# EAGLE schematic ls schematic v30 (EAGLE 9.7.0)
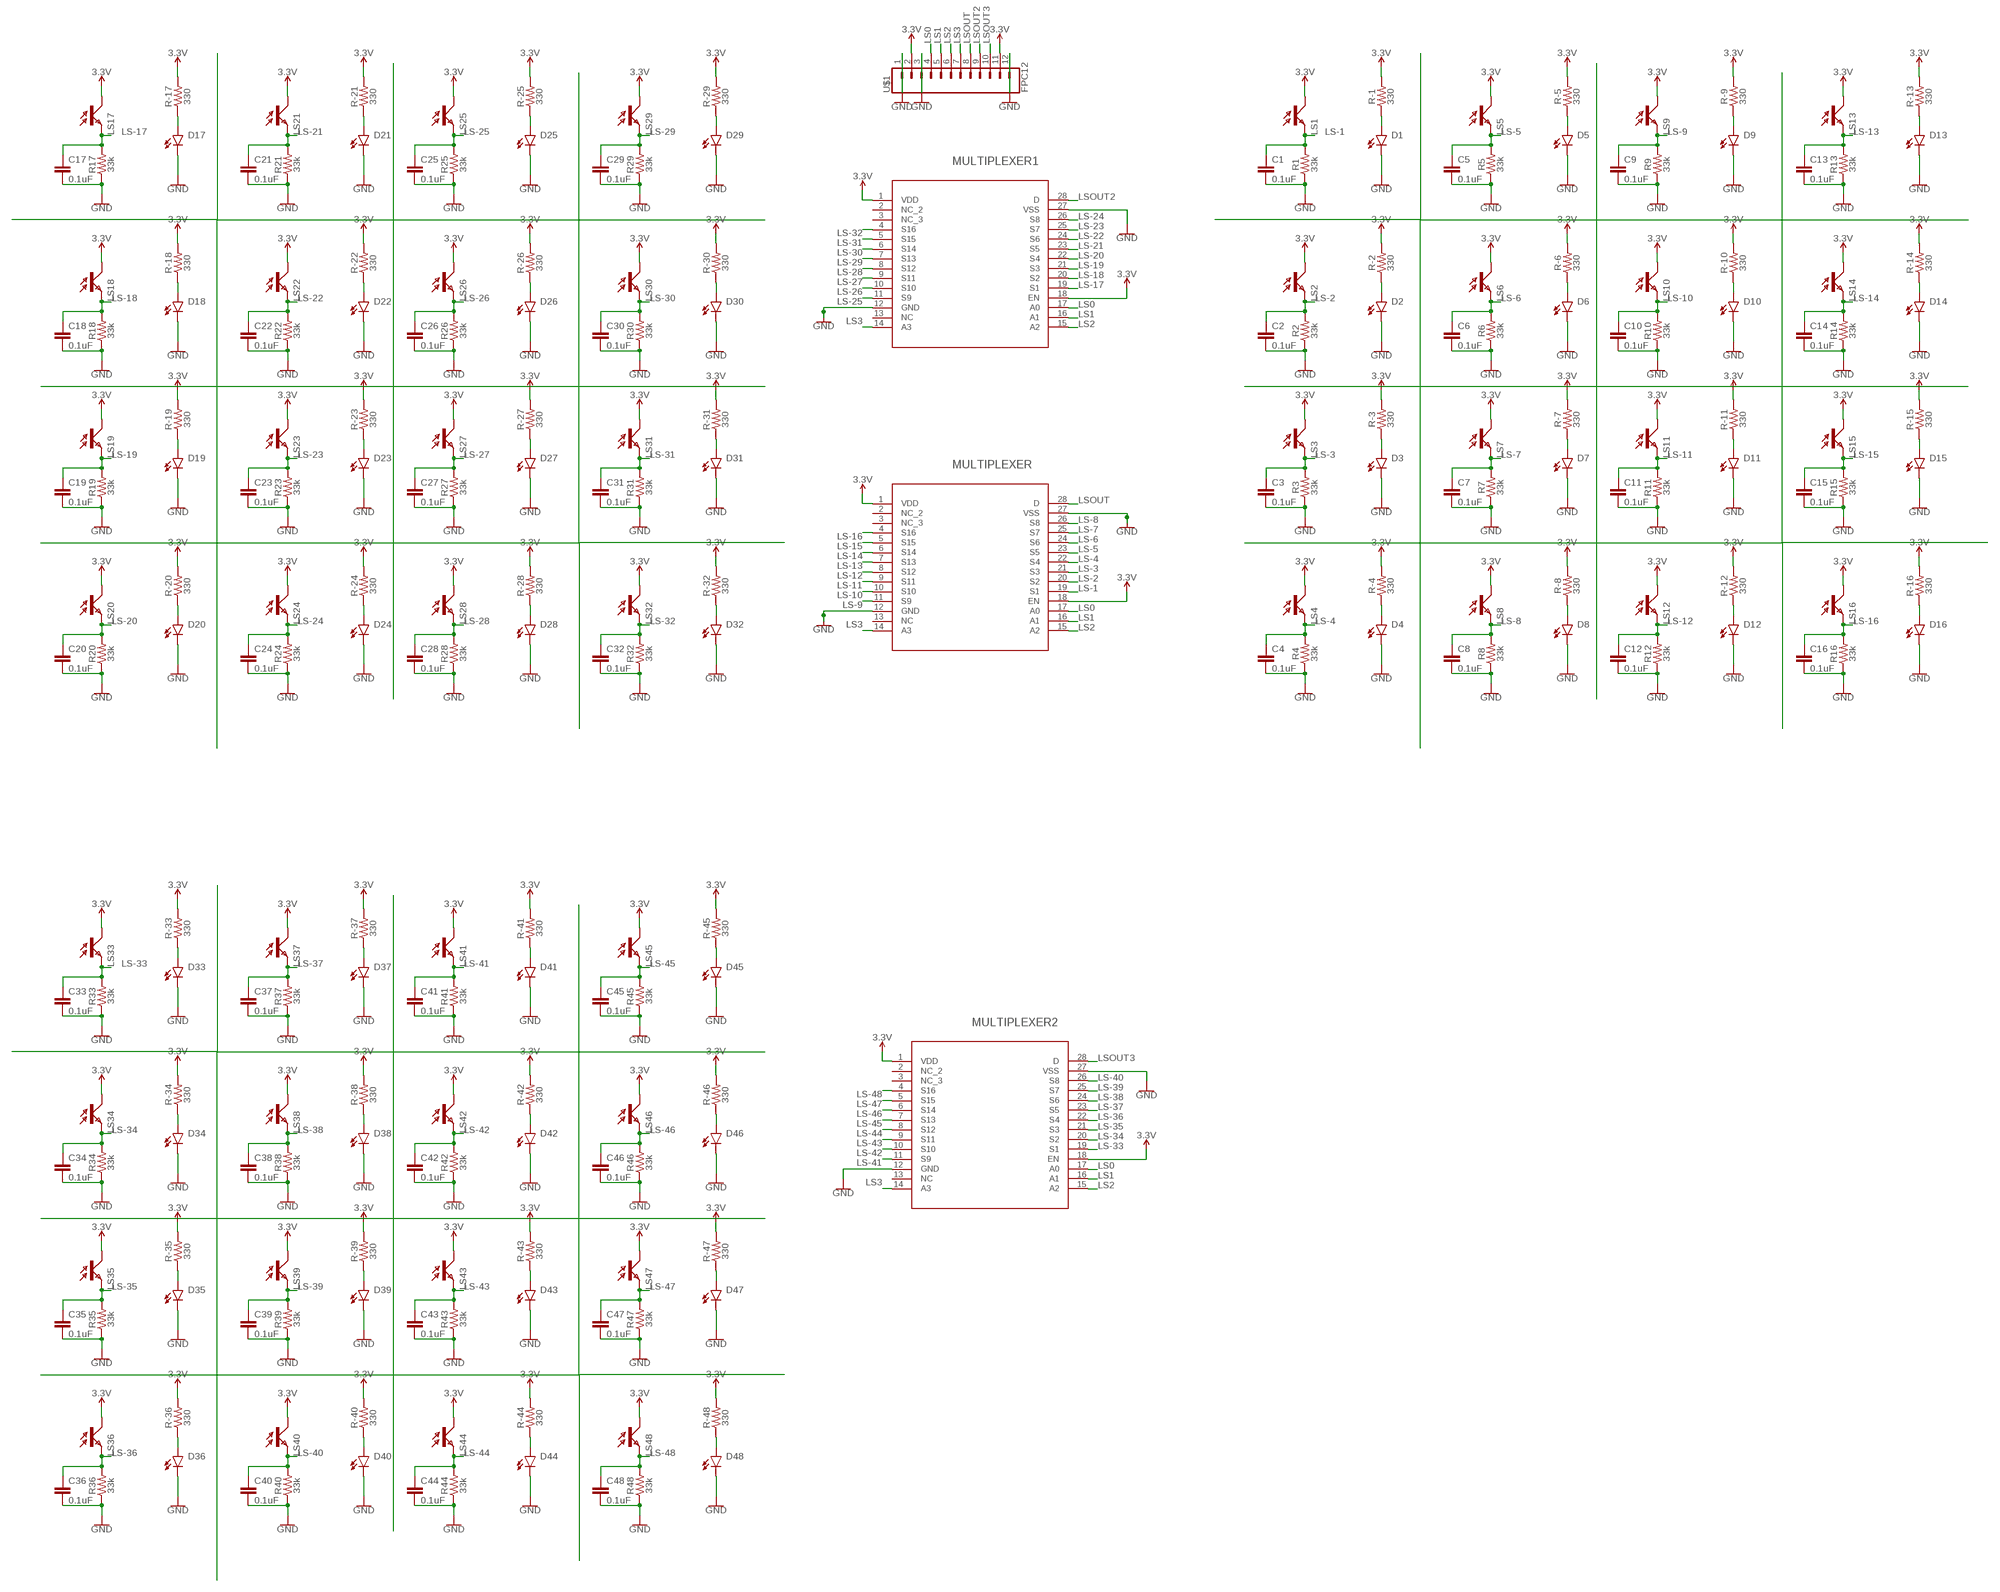
[diagram p0: schematic, sheet 1]

## Parts
C1  0.1uF  0.1UF-0603-100V-10%  [0603]
C2  0.1uF  0.1UF-0603-100V-10%  [0603]
C3  0.1uF  0.1UF-0603-100V-10%  [0603]
C4  0.1uF  0.1UF-0603-100V-10%  [0603]
C5  0.1uF  0.1UF-0603-100V-10%  [0603]
C6  0.1uF  0.1UF-0603-100V-10%  [0603]
C7  0.1uF  0.1UF-0603-100V-10%  [0603]
C8  0.1uF  0.1UF-0603-100V-10%  [0603]
C9  0.1uF  0.1UF-0603-100V-10%  [0603]
C10  0.1uF  0.1UF-0603-100V-10%  [0603]
C11  0.1uF  0.1UF-0603-100V-10%  [0603]
C12  0.1uF  0.1UF-0603-100V-10%  [0603]
C13  0.1uF  0.1UF-0603-100V-10%  [0603]
C14  0.1uF  0.1UF-0603-100V-10%  [0603]
C15  0.1uF  0.1UF-0603-100V-10%  [0603]
C16  0.1uF  0.1UF-0603-100V-10%  [0603]
C17  0.1uF  0.1UF-0603-100V-10%  [0603]
C18  0.1uF  0.1UF-0603-100V-10%  [0603]
C19  0.1uF  0.1UF-0603-100V-10%  [0603]
C20  0.1uF  0.1UF-0603-100V-10%  [0603]
C21  0.1uF  0.1UF-0603-100V-10%  [0603]
C22  0.1uF  0.1UF-0603-100V-10%  [0603]
C23  0.1uF  0.1UF-0603-100V-10%  [0603]
C24  0.1uF  0.1UF-0603-100V-10%  [0603]
C25  0.1uF  0.1UF-0603-100V-10%  [0603]
C26  0.1uF  0.1UF-0603-100V-10%  [0603]
C27  0.1uF  0.1UF-0603-100V-10%  [0603]
C28  0.1uF  0.1UF-0603-100V-10%  [0603]
C29  0.1uF  0.1UF-0603-100V-10%  [0603]
C30  0.1uF  0.1UF-0603-100V-10%  [0603]
C31  0.1uF  0.1UF-0603-100V-10%  [0603]
C32  0.1uF  0.1UF-0603-100V-10%  [0603]
C33  0.1uF  0.1UF-0603-100V-10%  [0603]
C34  0.1uF  0.1UF-0603-100V-10%  [0603]
C35  0.1uF  0.1UF-0603-100V-10%  [0603]
C36  0.1uF  0.1UF-0603-100V-10%  [0603]
C37  0.1uF  0.1UF-0603-100V-10%  [0603]
C38  0.1uF  0.1UF-0603-100V-10%  [0603]
C39  0.1uF  0.1UF-0603-100V-10%  [0603]
C40  0.1uF  0.1UF-0603-100V-10%  [0603]
C41  0.1uF  0.1UF-0603-100V-10%  [0603]
C42  0.1uF  0.1UF-0603-100V-10%  [0603]
C43  0.1uF  0.1UF-0603-100V-10%  [0603]
C44  0.1uF  0.1UF-0603-100V-10%  [0603]
C45  0.1uF  0.1UF-0603-100V-10%  [0603]
C46  0.1uF  0.1UF-0603-100V-10%  [0603]
C47  0.1uF  0.1UF-0603-100V-10%  [0603]
C48  0.1uF  0.1UF-0603-100V-10%  [0603]
D1  CHIP-FLAT-B_0603-0.35MM  [LEDC1608X35N_FLAT-B]
D2  CHIP-FLAT-B_0603-0.35MM  [LEDC1608X35N_FLAT-B]
D3  CHIP-FLAT-B_0603-0.35MM  [LEDC1608X35N_FLAT-B]
D4  CHIP-FLAT-B_0603-0.35MM  [LEDC1608X35N_FLAT-B]
D5  CHIP-FLAT-B_0603-0.35MM  [LEDC1608X35N_FLAT-B]
D6  CHIP-FLAT-B_0603-0.35MM  [LEDC1608X35N_FLAT-B]
D7  CHIP-FLAT-B_0603-0.35MM  [LEDC1608X35N_FLAT-B]
D8  CHIP-FLAT-B_0603-0.35MM  [LEDC1608X35N_FLAT-B]
D9  CHIP-FLAT-B_0603-0.35MM  [LEDC1608X35N_FLAT-B]
D10  CHIP-FLAT-B_0603-0.35MM  [LEDC1608X35N_FLAT-B]
D11  CHIP-FLAT-B_0603-0.35MM  [LEDC1608X35N_FLAT-B]
D12  CHIP-FLAT-B_0603-0.35MM  [LEDC1608X35N_FLAT-B]
D13  CHIP-FLAT-B_0603-0.35MM  [LEDC1608X35N_FLAT-B]
D14  CHIP-FLAT-B_0603-0.35MM  [LEDC1608X35N_FLAT-B]
D15  CHIP-FLAT-B_0603-0.35MM  [LEDC1608X35N_FLAT-B]
D16  CHIP-FLAT-B_0603-0.35MM  [LEDC1608X35N_FLAT-B]
D17  CHIP-FLAT-B_0603-0.35MM  [LEDC1608X35N_FLAT-B]
D18  CHIP-FLAT-B_0603-0.35MM  [LEDC1608X35N_FLAT-B]
D19  CHIP-FLAT-B_0603-0.35MM  [LEDC1608X35N_FLAT-B]
D20  CHIP-FLAT-B_0603-0.35MM  [LEDC1608X35N_FLAT-B]
D21  CHIP-FLAT-B_0603-0.35MM  [LEDC1608X35N_FLAT-B]
D22  CHIP-FLAT-B_0603-0.35MM  [LEDC1608X35N_FLAT-B]
D23  CHIP-FLAT-B_0603-0.35MM  [LEDC1608X35N_FLAT-B]
D24  CHIP-FLAT-B_0603-0.35MM  [LEDC1608X35N_FLAT-B]
D25  CHIP-FLAT-B_0603-0.35MM  [LEDC1608X35N_FLAT-B]
D26  CHIP-FLAT-B_0603-0.35MM  [LEDC1608X35N_FLAT-B]
D27  CHIP-FLAT-B_0603-0.35MM  [LEDC1608X35N_FLAT-B]
D28  CHIP-FLAT-B_0603-0.35MM  [LEDC1608X35N_FLAT-B]
D29  CHIP-FLAT-B_0603-0.35MM  [LEDC1608X35N_FLAT-B]
D30  CHIP-FLAT-B_0603-0.35MM  [LEDC1608X35N_FLAT-B]
D31  CHIP-FLAT-B_0603-0.35MM  [LEDC1608X35N_FLAT-B]
D32  CHIP-FLAT-B_0603-0.35MM  [LEDC1608X35N_FLAT-B]
D33  CHIP-FLAT-B_0603-0.35MM  [LEDC1608X35N_FLAT-B]
D34  CHIP-FLAT-B_0603-0.35MM  [LEDC1608X35N_FLAT-B]
D35  CHIP-FLAT-B_0603-0.35MM  [LEDC1608X35N_FLAT-B]
D36  CHIP-FLAT-B_0603-0.35MM  [LEDC1608X35N_FLAT-B]
D37  CHIP-FLAT-B_0603-0.35MM  [LEDC1608X35N_FLAT-B]
D38  CHIP-FLAT-B_0603-0.35MM  [LEDC1608X35N_FLAT-B]
D39  CHIP-FLAT-B_0603-0.35MM  [LEDC1608X35N_FLAT-B]
D40  CHIP-FLAT-B_0603-0.35MM  [LEDC1608X35N_FLAT-B]
D41  CHIP-FLAT-B_0603-0.35MM  [LEDC1608X35N_FLAT-B]
D42  CHIP-FLAT-B_0603-0.35MM  [LEDC1608X35N_FLAT-B]
D43  CHIP-FLAT-B_0603-0.35MM  [LEDC1608X35N_FLAT-B]
D44  CHIP-FLAT-B_0603-0.35MM  [LEDC1608X35N_FLAT-B]
D45  CHIP-FLAT-B_0603-0.35MM  [LEDC1608X35N_FLAT-B]
D46  CHIP-FLAT-B_0603-0.35MM  [LEDC1608X35N_FLAT-B]
D47  CHIP-FLAT-B_0603-0.35MM  [LEDC1608X35N_FLAT-B]
D48  CHIP-FLAT-B_0603-0.35MM  [LEDC1608X35N_FLAT-B]
LS1  ALS  [SMD]
LS2  ALS  [SMD]
LS3  ALS  [SMD]
LS4  ALS  [SMD]
LS5  ALS  [SMD]
LS6  ALS  [SMD]
LS7  ALS  [SMD]
LS8  ALS  [SMD]
LS9  ALS  [SMD]
LS10  ALS  [SMD]
LS11  ALS  [SMD]
LS12  ALS  [SMD]
LS13  ALS  [SMD]
LS14  ALS  [SMD]
LS15  ALS  [SMD]
LS16  ALS  [SMD]
LS17  ALS  [SMD]
LS18  ALS  [SMD]
LS19  ALS  [SMD]
LS20  ALS  [SMD]
LS21  ALS  [SMD]
LS22  ALS  [SMD]
LS23  ALS  [SMD]
LS24  ALS  [SMD]
LS25  ALS  [SMD]
LS26  ALS  [SMD]
LS27  ALS  [SMD]
LS28  ALS  [SMD]
LS29  ALS  [SMD]
LS30  ALS  [SMD]
LS31  ALS  [SMD]
LS32  ALS  [SMD]
LS33  ALS  [SMD]
LS34  ALS  [SMD]
LS35  ALS  [SMD]
LS36  ALS  [SMD]
LS37  ALS  [SMD]
LS38  ALS  [SMD]
LS39  ALS  [SMD]
LS40  ALS  [SMD]
LS41  ALS  [SMD]
LS42  ALS  [SMD]
LS43  ALS  [SMD]
LS44  ALS  [SMD]
LS45  ALS  [SMD]
LS46  ALS  [SMD]
LS47  ALS  [SMD]
LS48  ALS  [SMD]
MULTIPLEXER  ADG1206YRUZRU_28_ADI-L  [RU_28_ADI-L]
MULTIPLEXER1  ADG1206YRUZRU_28_ADI-L  [RU_28_ADI-L]
MULTIPLEXER2  ADG1206YRUZRU_28_ADI-L  [RU_28_ADI-L]
R1  33k  33KOHM-0603-1/10W-1%  [0603]
R2  33k  33KOHM-0603-1/10W-1%  [0603]
R3  33k  33KOHM-0603-1/10W-1%  [0603]
R4  33k  33KOHM-0603-1/10W-1%  [0603]
R5  33k  33KOHM-0603-1/10W-1%  [0603]
R6  33k  33KOHM-0603-1/10W-1%  [0603]
R7  33k  33KOHM-0603-1/10W-1%  [0603]
R8  33k  33KOHM-0603-1/10W-1%  [0603]
R9  33k  33KOHM-0603-1/10W-1%  [0603]
R10  33k  33KOHM-0603-1/10W-1%  [0603]
R11  33k  33KOHM-0603-1/10W-1%  [0603]
R12  33k  33KOHM-0603-1/10W-1%  [0603]
R13  33k  33KOHM-0603-1/10W-1%  [0603]
R14  33k  33KOHM-0603-1/10W-1%  [0603]
R15  33k  33KOHM-0603-1/10W-1%  [0603]
R16  33k  33KOHM-0603-1/10W-1%  [0603]
R17  33k  33KOHM-0603-1/10W-1%  [0603]
R18  33k  33KOHM-0603-1/10W-1%  [0603]
R19  33k  33KOHM-0603-1/10W-1%  [0603]
R20  33k  33KOHM-0603-1/10W-1%  [0603]
R21  33k  33KOHM-0603-1/10W-1%  [0603]
R22  33k  33KOHM-0603-1/10W-1%  [0603]
R23  33k  33KOHM-0603-1/10W-1%  [0603]
R24  33k  33KOHM-0603-1/10W-1%  [0603]
R25  33k  33KOHM-0603-1/10W-1%  [0603]
R26  33k  33KOHM-0603-1/10W-1%  [0603]
R27  33k  33KOHM-0603-1/10W-1%  [0603]
R28  33k  33KOHM-0603-1/10W-1%  [0603]
R29  33k  33KOHM-0603-1/10W-1%  [0603]
R30  33k  33KOHM-0603-1/10W-1%  [0603]
R31  33k  33KOHM-0603-1/10W-1%  [0603]
R32  33k  33KOHM-0603-1/10W-1%  [0603]
R33  33k  33KOHM-0603-1/10W-1%  [0603]
R34  33k  33KOHM-0603-1/10W-1%  [0603]
R35  33k  33KOHM-0603-1/10W-1%  [0603]
R36  33k  33KOHM-0603-1/10W-1%  [0603]
R37  33k  33KOHM-0603-1/10W-1%  [0603]
R38  33k  33KOHM-0603-1/10W-1%  [0603]
R39  33k  33KOHM-0603-1/10W-1%  [0603]
R40  33k  33KOHM-0603-1/10W-1%  [0603]
R41  33k  33KOHM-0603-1/10W-1%  [0603]
R42  33k  33KOHM-0603-1/10W-1%  [0603]
R43  33k  33KOHM-0603-1/10W-1%  [0603]
R44  33k  33KOHM-0603-1/10W-1%  [0603]
R45  33k  33KOHM-0603-1/10W-1%  [0603]
R46  33k  33KOHM-0603-1/10W-1%  [0603]
R47  33k  33KOHM-0603-1/10W-1%  [0603]
R48  33k  33KOHM-0603-1/10W-1%  [0603]
R-1  330  330KOHM-0603-1/10W-1%  [0603]
R-2  330  330KOHM-0603-1/10W-1%  [0603]
R-3  330  330KOHM-0603-1/10W-1%  [0603]
R-4  330  330KOHM-0603-1/10W-1%  [0603]
R-5  330  330KOHM-0603-1/10W-1%  [0603]
R-6  330  330KOHM-0603-1/10W-1%  [0603]
R-7  330  330KOHM-0603-1/10W-1%  [0603]
R-8  330  330KOHM-0603-1/10W-1%  [0603]
R-9  330  330KOHM-0603-1/10W-1%  [0603]
R-10  330  330KOHM-0603-1/10W-1%  [0603]
R-11  330  330KOHM-0603-1/10W-1%  [0603]
R-12  330  330KOHM-0603-1/10W-1%  [0603]
R-13  330  330KOHM-0603-1/10W-1%  [0603]
R-14  330  330KOHM-0603-1/10W-1%  [0603]
R-15  330  330KOHM-0603-1/10W-1%  [0603]
R-16  330  330KOHM-0603-1/10W-1%  [0603]
R-17  330  330KOHM-0603-1/10W-1%  [0603]
R-18  330  330KOHM-0603-1/10W-1%  [0603]
R-19  330  330KOHM-0603-1/10W-1%  [0603]
R-20  330  330KOHM-0603-1/10W-1%  [0603]
R-21  330  330KOHM-0603-1/10W-1%  [0603]
R-22  330  330KOHM-0603-1/10W-1%  [0603]
R-23  330  330KOHM-0603-1/10W-1%  [0603]
R-24  330  330KOHM-0603-1/10W-1%  [0603]
R-25  330  330KOHM-0603-1/10W-1%  [0603]
R-26  330  330KOHM-0603-1/10W-1%  [0603]
R-27  330  330KOHM-0603-1/10W-1%  [0603]
R-28  330  330KOHM-0603-1/10W-1%  [0603]
R-29  330  330KOHM-0603-1/10W-1%  [0603]
R-30  330  330KOHM-0603-1/10W-1%  [0603]
R-31  330  330KOHM-0603-1/10W-1%  [0603]
R-32  330  330KOHM-0603-1/10W-1%  [0603]
R-33  330  330KOHM-0603-1/10W-1%  [0603]
R-34  330  330KOHM-0603-1/10W-1%  [0603]
R-35  330  330KOHM-0603-1/10W-1%  [0603]
R-36  330  330KOHM-0603-1/10W-1%  [0603]
R-37  330  330KOHM-0603-1/10W-1%  [0603]
R-38  330  330KOHM-0603-1/10W-1%  [0603]
R-39  330  330KOHM-0603-1/10W-1%  [0603]
R-40  330  330KOHM-0603-1/10W-1%  [0603]
R-41  330  330KOHM-0603-1/10W-1%  [0603]
R-42  330  330KOHM-0603-1/10W-1%  [0603]
R-43  330  330KOHM-0603-1/10W-1%  [0603]
R-44  330  330KOHM-0603-1/10W-1%  [0603]
R-45  330  330KOHM-0603-1/10W-1%  [0603]
R-46  330  330KOHM-0603-1/10W-1%  [0603]
R-47  330  330KOHM-0603-1/10W-1%  [0603]
R-48  330  330KOHM-0603-1/10W-1%  [0603]
U$1  FPC12  [FPC12]

## Nets
3.3V: LS1.C LS2.C LS3.C LS4.C LS5.C LS6.C LS7.C LS8.C LS9.C LS10.C LS11.C LS12.C LS13.C LS14.C LS15.C LS16.C LS17.C LS18.C LS19.C LS20.C LS21.C LS22.C LS23.C LS24.C LS25.C LS26.C LS27.C LS28.C LS29.C LS30.C LS31.C LS32.C LS33.C LS34.C LS35.C LS36.C LS37.C LS38.C LS39.C LS40.C LS41.C LS42.C LS43.C LS44.C LS45.C LS46.C LS47.C LS48.C MULTIPLEXER1.1(VDD) MULTIPLEXER1.18(EN) MULTIPLEXER2.1(VDD) MULTIPLEXER2.18(EN) MULTIPLEXER.1(VDD) MULTIPLEXER.18(EN) R-1.2 R-2.2 R-3.2 R-4.2 R-5.2 R-6.2 R-7.2 R-8.2 R-9.2 R-10.2 R-11.2 R-12.2 R-13.2 R-14.2 R-15.2 R-16.2 R-17.2 R-18.2 R-19.2 R-20.2 R-21.2 R-22.2 R-23.2 R-24.2 R-25.2 R-26.2 R-27.2 R-28.2 R-29.2 R-30.2 R-31.2 R-32.2 R-33.2 R-34.2 R-35.2 R-36.2 R-37.2 R-38.2 R-39.2 R-40.2 R-41.2 R-42.2 R-43.2 R-44.2 R-45.2 R-46.2 R-47.2 R-48.2 U$1.2 U$1.11
GND: C1.2 C2.2 C3.2 C4.2 C5.2 C6.2 C7.2 C8.2 C9.2 C10.2 C11.2 C12.2 C13.2 C14.2 C15.2 C16.2 C17.2 C18.2 C19.2 C20.2 C21.2 C22.2 C23.2 C24.2 C25.2 C26.2 C27.2 C28.2 C29.2 C30.2 C31.2 C32.2 C33.2 C34.2 C35.2 C36.2 C37.2 C38.2 C39.2 C40.2 C41.2 C42.2 C43.2 C44.2 C45.2 C46.2 C47.2 C48.2 D1.C D2.C D3.C D4.C D5.C D6.C D7.C D8.C D9.C D10.C D11.C D12.C D13.C D14.C D15.C D16.C D17.C D18.C D19.C D20.C D21.C D22.C D23.C D24.C D25.C D26.C D27.C D28.C D29.C D30.C D31.C D32.C D33.C D34.C D35.C D36.C D37.C D38.C D39.C D40.C D41.C D42.C D43.C D44.C D45.C D46.C D47.C D48.C MULTIPLEXER1.12(GND) MULTIPLEXER1.27(VSS) MULTIPLEXER2.12(GND) MULTIPLEXER2.27(VSS) MULTIPLEXER.12(GND) MULTIPLEXER.27(VSS) R1.1 R2.1 R3.1 R4.1 R5.1 R6.1 R7.1 R8.1 R9.1 R10.1 R11.1 R12.1 R13.1 R14.1 R15.1 R16.1 R17.1 R18.1 R19.1 R20.1 R21.1 R22.1 R23.1 R24.1 R25.1 R26.1 R27.1 R28.1 R29.1 R30.1 R31.1 R32.1 R33.1 R34.1 R35.1 R36.1 R37.1 R38.1 R39.1 R40.1 R41.1 R42.1 R43.1 R44.1 R45.1 R46.1 R47.1 R48.1 U$1.1 U$1.3 U$1.12
LS0: MULTIPLEXER1.17(A0) MULTIPLEXER2.17(A0) MULTIPLEXER.17(A0) U$1.4
LS1: MULTIPLEXER1.16(A1) MULTIPLEXER2.16(A1) MULTIPLEXER.16(A1) U$1.5
LS2: MULTIPLEXER1.15(A2) MULTIPLEXER2.15(A2) MULTIPLEXER.15(A2) U$1.6
LS3: MULTIPLEXER1.14(A3) MULTIPLEXER2.14(A3) MULTIPLEXER.14(A3) U$1.7
LS-1: C1.1 LS1.E MULTIPLEXER.19(S1) R1.2
LS-2: C2.1 LS2.E MULTIPLEXER.20(S2) R2.2
LS-3: C3.1 LS3.E MULTIPLEXER.21(S3) R3.2
LS-4: C4.1 LS4.E MULTIPLEXER.22(S4) R4.2
LS-5: C5.1 LS5.E MULTIPLEXER.23(S5) R5.2
LS-6: C6.1 LS6.E MULTIPLEXER.24(S6) R6.2
LS-7: C7.1 LS7.E MULTIPLEXER.25(S7) R7.2
LS-8: C8.1 LS8.E MULTIPLEXER.26(S8) R8.2
LS-9: C9.1 LS9.E MULTIPLEXER.11(S9) R9.2
LS-10: C10.1 LS10.E MULTIPLEXER.10(S10) R10.2
LS-11: C11.1 LS11.E MULTIPLEXER.9(S11) R11.2
LS-12: C12.1 LS12.E MULTIPLEXER.8(S12) R12.2
LS-13: C13.1 LS13.E MULTIPLEXER.7(S13) R13.2
LS-14: C14.1 LS14.E MULTIPLEXER.6(S14) R14.2
LS-15: C15.1 LS15.E MULTIPLEXER.5(S15) R15.2
LS-16: C16.1 LS16.E MULTIPLEXER.4(S16) R16.2
LS-17: C17.1 LS17.E MULTIPLEXER1.19(S1) R17.2
LS-18: C18.1 LS18.E MULTIPLEXER1.20(S2) R18.2
LS-19: C19.1 LS19.E MULTIPLEXER1.21(S3) R19.2
LS-20: C20.1 LS20.E MULTIPLEXER1.22(S4) R20.2
LS-21: C21.1 LS21.E MULTIPLEXER1.23(S5) R21.2
LS-22: C22.1 LS22.E MULTIPLEXER1.24(S6) R22.2
LS-23: C23.1 LS23.E MULTIPLEXER1.25(S7) R23.2
LS-24: C24.1 LS24.E MULTIPLEXER1.26(S8) R24.2
LS-25: C25.1 LS25.E MULTIPLEXER1.11(S9) R25.2
LS-26: C26.1 LS26.E MULTIPLEXER1.10(S10) R26.2
LS-27: C27.1 LS27.E MULTIPLEXER1.9(S11) R27.2
LS-28: C28.1 LS28.E MULTIPLEXER1.8(S12) R28.2
LS-29: C29.1 LS29.E MULTIPLEXER1.7(S13) R29.2
LS-30: C30.1 LS30.E MULTIPLEXER1.6(S14) R30.2
LS-31: C31.1 LS31.E MULTIPLEXER1.5(S15) R31.2
LS-32: C32.1 LS32.E MULTIPLEXER1.4(S16) R32.2
LS-33: C33.1 LS33.E MULTIPLEXER2.19(S1) R33.2
LS-34: C34.1 LS34.E MULTIPLEXER2.20(S2) R34.2
LS-35: C35.1 LS35.E MULTIPLEXER2.21(S3) R35.2
LS-36: C36.1 LS36.E MULTIPLEXER2.22(S4) R36.2
LS-37: C37.1 LS37.E MULTIPLEXER2.23(S5) R37.2
LS-38: C38.1 LS38.E MULTIPLEXER2.24(S6) R38.2
LS-39: C39.1 LS39.E MULTIPLEXER2.25(S7) R39.2
LS-40: C40.1 LS40.E MULTIPLEXER2.26(S8) R40.2
LS-41: C41.1 LS41.E MULTIPLEXER2.11(S9) R41.2
LS-42: C42.1 LS42.E MULTIPLEXER2.10(S10) R42.2
LS-43: C43.1 LS43.E MULTIPLEXER2.9(S11) R43.2
LS-44: C44.1 LS44.E MULTIPLEXER2.8(S12) R44.2
LS-45: C45.1 LS45.E MULTIPLEXER2.7(S13) R45.2
LS-46: C46.1 LS46.E MULTIPLEXER2.6(S14) R46.2
LS-47: C47.1 LS47.E MULTIPLEXER2.5(S15) R47.2
LS-48: C48.1 LS48.E MULTIPLEXER2.4(S16) R48.2
LSOUT: MULTIPLEXER.28(D) U$1.8
LSOUT2: MULTIPLEXER1.28(D) U$1.9
LSOUT3: MULTIPLEXER2.28(D) U$1.10
N$1: D1.A R-1.1
N$2: D2.A R-2.1
N$3: D3.A R-3.1
N$4: D4.A R-4.1
N$5: D5.A R-5.1
N$6: D6.A R-6.1
N$7: D7.A R-7.1
N$8: D8.A R-8.1
N$9: D9.A R-9.1
N$10: D10.A R-10.1
N$11: D11.A R-11.1
N$12: D12.A R-12.1
N$13: D13.A R-13.1
N$14: D14.A R-14.1
N$15: D15.A R-15.1
N$16: D16.A R-16.1
N$19: D17.A R-17.1
N$22: D18.A R-18.1
N$23: D19.A R-19.1
N$24: D20.A R-20.1
N$25: D21.A R-21.1
N$26: D22.A R-22.1
N$27: D23.A R-23.1
N$28: D24.A R-24.1
N$29: D25.A R-25.1
N$30: D26.A R-26.1
N$31: D27.A R-27.1
N$32: D33.A R-33.1
N$33: D34.A R-34.1
N$34: D35.A R-35.1
N$35: D36.A R-36.1
N$36: D37.A R-37.1
N$37: D28.A R-28.1
N$38: D29.A R-29.1
N$39: D30.A R-30.1
N$40: D31.A R-31.1
N$41: D32.A R-32.1
N$46: D38.A R-38.1
N$47: D39.A R-39.1
N$48: D40.A R-40.1
N$49: D41.A R-41.1
N$50: D42.A R-42.1
N$51: D43.A R-43.1
N$52: D44.A R-44.1
N$53: D45.A R-45.1
N$54: D46.A R-46.1
N$55: D47.A R-47.1
N$56: D48.A R-48.1
Unconnected: MULTIPLEXER1.2(NC_2) MULTIPLEXER1.3(NC_3) MULTIPLEXER1.13(NC) MULTIPLEXER2.2(NC_2) MULTIPLEXER2.3(NC_3) MULTIPLEXER2.13(NC) MULTIPLEXER.2(NC_2) MULTIPLEXER.3(NC_3) MULTIPLEXER.13(NC)

## Library data of the parts
C1-C48 = SparkFun-Capacitors:0.1UF: 0.1µF ceramic capacitors A capacitor is a passive two-terminal electrical component used to store electrical energy temporarily in an electric field.; PROD_ID: CAP-08390
D1-D48 = LED:CHIP-FLAT-B; CATEGORY: LED; COLOR: BLUE; DESCRIPTION: CHIP LED FLAT; SUB-CATEGORY: CHIP; TYPE: FLAT_TOP; VALUE: LED_BLUE
LS1-LS48 = phototransitor-ALS-PT19-315CL177TR8:ALS
MULTIPLEXER MULTIPLEXER1 MULTIPLEXER2 = ADG1206:ADG1206YRUZ; COPYRIGHT: Copyright (C) 2022 Ultra Librarian. All rights reserved.; MANUFACTURER_PART_NUMBER: ADG1206YRUZ; MFR_NAME: Analog Devices Inc
R1-R48 = SparkFun-Resistors:33KOHM: 33kΩ resistor A resistor is a passive two-terminal electrical component that implements electrical resistance as a circuit element. Resistors act to reduce current flow, and, at the same time, act to lower voltage levels within circuits. - Wikipedia; PROD_ID: RES-08416
R-1-R-48 = SparkFun-Resistors:330KOHM: 330kΩ resistor A resistor is a passive two-terminal electrical component that implements electrical resistance as a circuit element. Resistors act to reduce current flow, and, at the same time, act to lower voltage levels within circuits. - Wikipedia; PROD_ID: RES-08968; VALUE: 330k
U$1 = FFC:FPC12